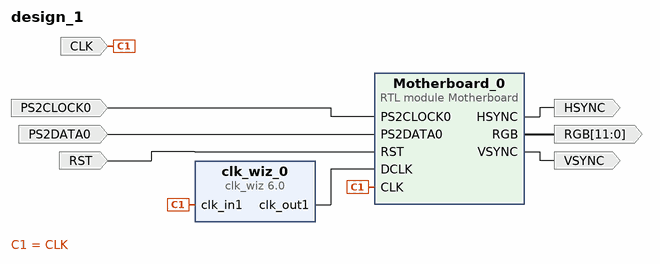
[diagram p0: block diagram of the top level]
# Vivado block design design_1, xc7z020clg484-1, Vivado 2023.2
create_bd_design design_1

create_bd_port -dir I -type rst RST
create_bd_port -dir I PS2CLOCK0
create_bd_port -dir I PS2DATA0
create_bd_port -dir O HSYNC
create_bd_port -dir O -from 11 -to 0 RGB
create_bd_port -dir O VSYNC
create_bd_port -dir I -type clk CLK
set_property -dict {CONFIG.FREQ_HZ 200000000} [get_bd_ports CLK]

create_bd_cell -type module -reference Motherboard Motherboard_0
create_bd_cell -type ip -vlnv xilinx.com:ip:clk_wiz:6.0 clk_wiz_0
set_property -dict [list \
  CONFIG.CLKOUT1_JITTER 98.146 \
  CONFIG.CLKOUT1_REQUESTED_OUT_FREQ 200 \
  CONFIG.MMCM_CLKOUT0_DIVIDE_F 5.000 \
  CONFIG.USE_LOCKED false \
  CONFIG.USE_RESET false \
] [get_bd_cells clk_wiz_0]

# ---- connections ----

connect_bd_net -net CLK_0_1 [get_bd_ports CLK] [get_bd_pins clk_wiz_0/clk_in1] [get_bd_pins Motherboard_0/CLK]
connect_bd_net [get_bd_pins Motherboard_0/HSYNC] [get_bd_ports HSYNC]
connect_bd_net [get_bd_pins Motherboard_0/RGB] [get_bd_ports RGB]
connect_bd_net [get_bd_pins Motherboard_0/VSYNC] [get_bd_ports VSYNC]
connect_bd_net -net PS2CLOCK0_0_1 [get_bd_ports PS2CLOCK0] [get_bd_pins Motherboard_0/PS2CLOCK0]
connect_bd_net -net PS2DATA0_0_1 [get_bd_ports PS2DATA0] [get_bd_pins Motherboard_0/PS2DATA0]
connect_bd_net -net RST_0_1 [get_bd_ports RST] [get_bd_pins Motherboard_0/RST]
connect_bd_net [get_bd_pins clk_wiz_0/clk_out1] [get_bd_pins Motherboard_0/DCLK]

validate_bd_design
save_bd_design
